# EAGLE design nes-programmer-1 (EAGLE 9.6.2)
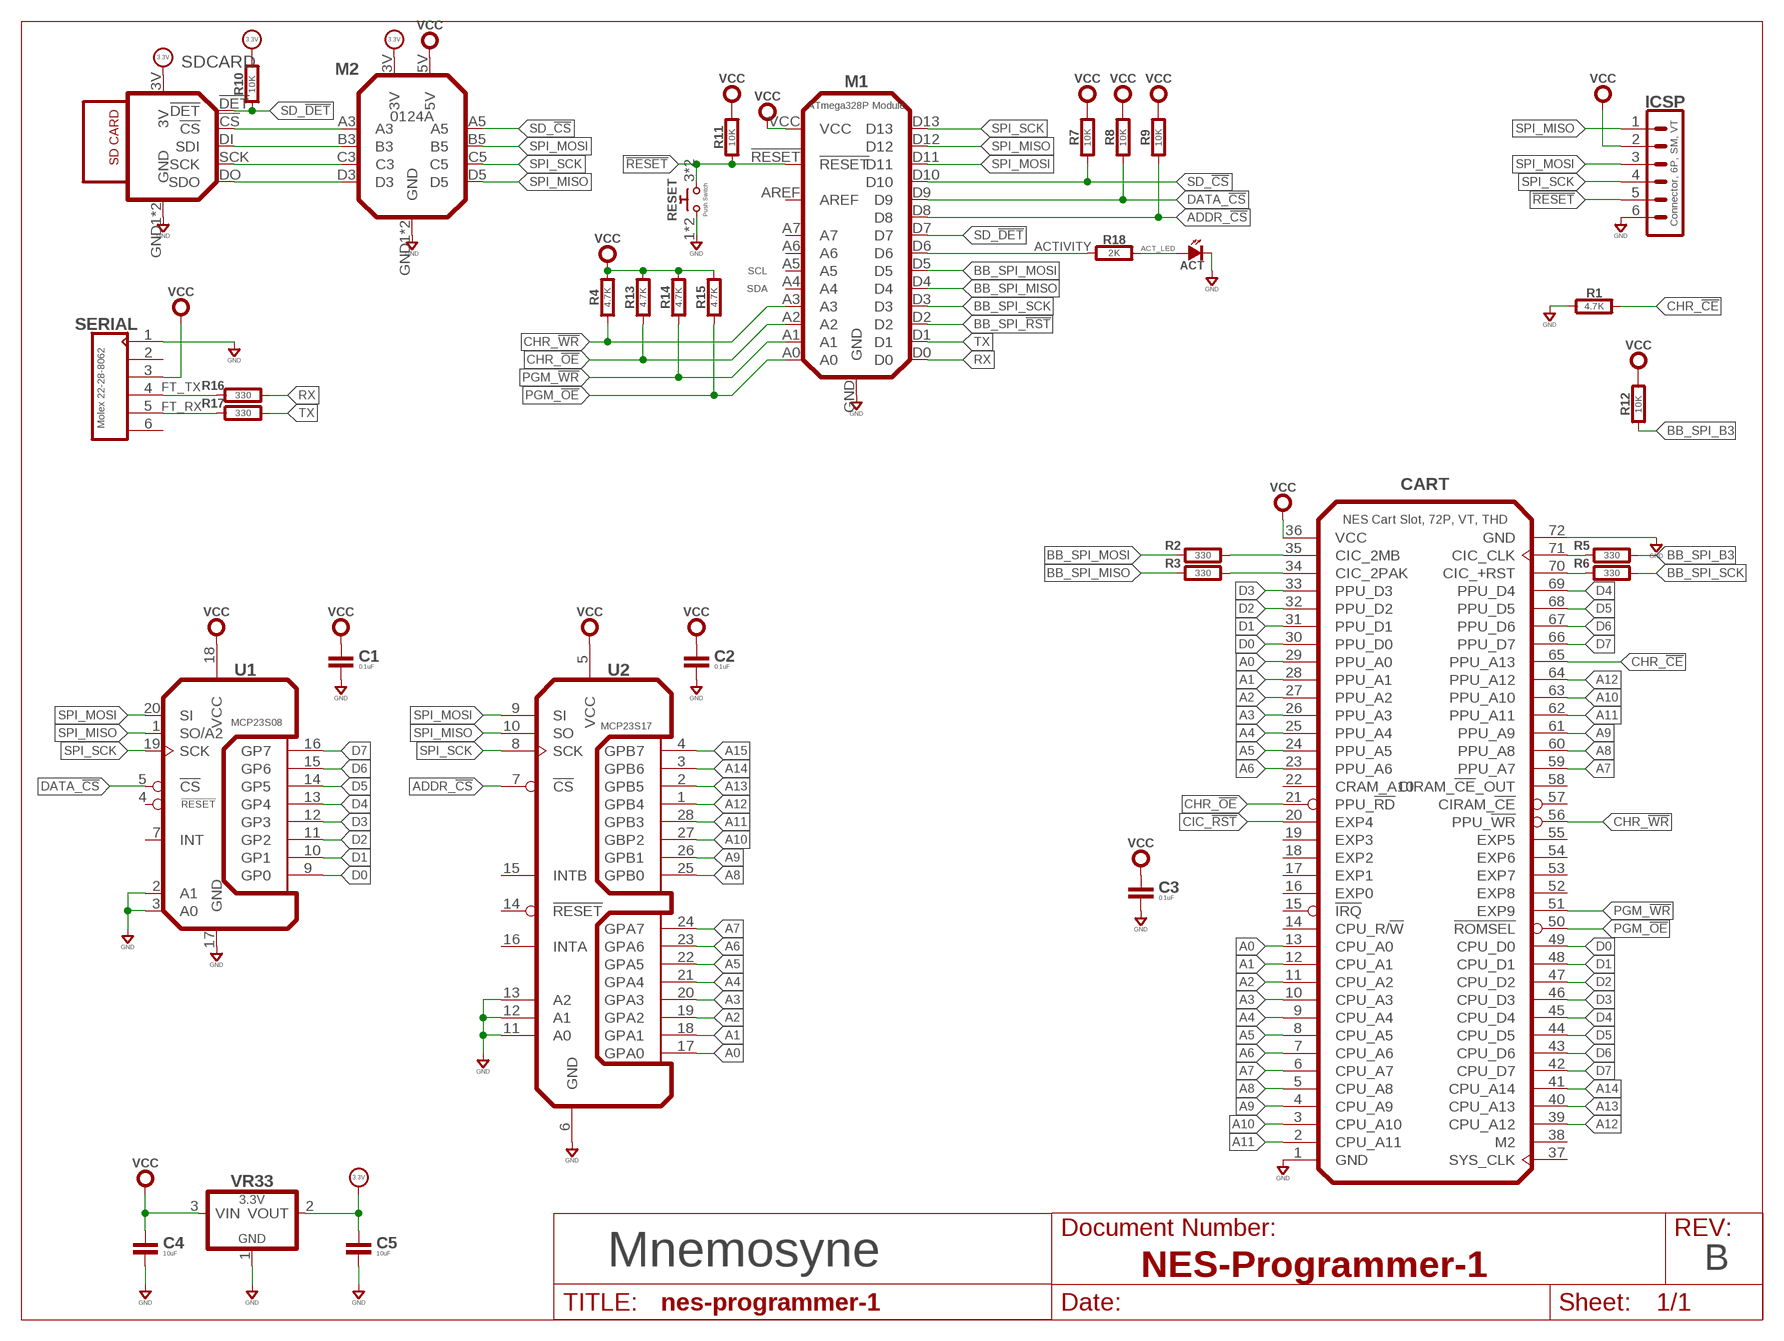
[diagram p0: schematic, sheet 1]
FRAME1 (LETTER_L): DOCUMENT_NUMBER: NES-Programmer-1; REV: B

## Parts
ACT  SMT0603  [SMD_0603]
C1  0.1uF  CAPACITOR0603  [0603-CAP]
C2  0.1uF  CAPACITOR0603  [0603-CAP]
C3  0.1uF  CAPACITOR0603  [0603-CAP]
C4  10uF  CAPACITOR0603  [0603-CAP]
C5  10uF  CAPACITOR0603  [0603-CAP]
CART  NES Cart Slot, 72P, VT, THD  NES-RECEPTACLE-VT-THD  [NES-CONNECTOR-VT-THD]
ICSP  Connector, 6P, SM, VT  06P-SM-VT-SMT  [BM06B-SRSS-TB]
M1  ATmega328P Module  0119REV-A  [0119A]
M2  0124A  0124REV-A  [0124A]
R1  4.7K  RESISTOR0603  [0603-RES]
R2  330  RESISTOR0603  [0603-RES]
R3  330  RESISTOR0603  [0603-RES]
R4  4.7K  RESISTOR0603  [0603-RES]
R5  330  RESISTOR0603  [0603-RES]
R6  330  RESISTOR0603  [0603-RES]
R7  10K  RESISTOR0603  [0603-RES]
R8  10K  RESISTOR0603  [0603-RES]
R9  10K  RESISTOR0603  [0603-RES]
R10  10K  RESISTOR0603  [0603-RES]
R11  10K  RESISTOR0603  [0603-RES]
R12  10K  RESISTOR0603  [0603-RES]
R13  4.7K  RESISTOR0603  [0603-RES]
R14  4.7K  RESISTOR0603  [0603-RES]
R15  4.7K  RESISTOR0603  [0603-RES]
R16  330  RESISTOR0603  [0603-RES]
R17  330  RESISTOR0603  [0603-RES]
R18  2K  RESISTOR0603  [0603-RES]
RESET  Push Switch  PUSHBTN-MOMB3SN  [B3SN]
SDCARD  0127REV-A  [0127A]
SERIAL  Molex 22-28-8062  CON_06X1-RA  [MA06X1-RA-THD]
U1  MCP23S08  MCP23S08-QFN  [QFN-20]
U2  MCP23S17  MCP23S17-QFN  [QFN-28-6X6]
VR33  3.3V  LDO-3P--3.3V-SOT23  [SOT-23]

## Nets
!RESET: ICSP.5 M1.!RESET R11.1 RESET.3 RESET.4
+3.3V: C5.1 M2.3V R10.2 SDCARD.3V VR33.2(VOUT) ; supply symbol labelled 3.3V
A0: CART.13(CPU_A0) CART.29(PPU_A0) U2.17(GPA0)
A1: CART.12(CPU_A1) CART.28(PPU_A1) U2.18(GPA1)
A2: CART.11(CPU_A2) CART.27(PPU_A2) U2.19(GPA2)
A3: CART.10(CPU_A3) CART.26(PPU_A3) U2.20(GPA3)
A4: CART.9(CPU_A4) CART.25(PPU_A4) U2.21(GPA4)
A5: CART.8(CPU_A5) CART.24(PPU_A5) U2.22(GPA5)
A6: CART.7(CPU_A6) CART.23(PPU_A6) U2.23(GPA6)
A7: CART.6(CPU_A7) CART.59(PPU_A7) U2.24(GPA7)
A8: CART.5(CPU_A8) CART.60(PPU_A8) U2.25(GPB0)
A9: CART.4(CPU_A9) CART.61(PPU_A9) U2.26(GPB1)
A10: CART.3(CPU_A10) CART.63(PPU_A10) U2.27(GBP2)
A11: CART.2(CPU_A11) CART.62(PPU_A11) U2.28(GPB3)
A12: CART.39(CPU_A12) CART.64(PPU_A12) U2.1(GPB4)
A13: CART.40(CPU_A13) U2.2(GPB5)
A14: CART.41(CPU_A14) U2.3(GPB6)
A15: U2.4(GPB7)
ACT_LED: ACT.A R18.2
ACTIVITY: M1.D6 R18.1
ADDR_!CS: M1.D8 R9.1 U2.7(!CS)
BB_SPI_!RST: M1.D2
BB_SPI_B3: R5.2 R12.1
BB_SPI_MISO: M1.D4 R3.1
BB_SPI_MOSI: M1.D5 R2.1
BB_SPI_SCK: M1.D3 R6.2
CHR_!CE: CART.65(PPU_A13) R1.2
CHR_!OE: CART.21(PPU_!RD) M1.A2 R13.1
CHR_!WR: CART.56(PPU_!WR) M1.A3 R4.1
CIC_2MB: CART.35(CIC_2MB) R2.2
CIC_2PAK: CART.34(CIC_2PAK) R3.2
CIC_!RST: CART.20(EXP4)
CIC_+RST: CART.70(CIC_+RST) R6.1
CIC_CLK: CART.71(CIC_CLK) R5.1
D0: CART.30(PPU_D0) CART.49(CPU_D0) U1.9(GP0)
D1: CART.31(PPU_D1) CART.48(CPU_D1) U1.10(GP1)
D2: CART.32(PPU_D2) CART.47(CPU_D2) U1.11(GP2)
D3: CART.33(PPU_D3) CART.46(CPU_D3) U1.12(GP3)
D4: CART.45(CPU_D4) CART.69(PPU_D4) U1.13(GP4)
D5: CART.44(CPU_D5) CART.68(PPU_D5) U1.14(GP5)
D6: CART.43(CPU_D6) CART.67(PPU_D6) U1.15(GP6)
D7: CART.42(CPU_D7) CART.66(PPU_D7) U1.16(GP7)
DATA_!CS: M1.D9 R8.1 U1.5(!CS)
FT_RX: R17.1 SERIAL.5
FT_TX: R16.1 SERIAL.4
GND: ACT.K(C) C1.2 C2.2 C3.2 C4.2 C5.2 CART.1(GND) CART.72(GND) ICSP.6 M1.GND M2.GND1(GND) M2.GND2(GND) R1.1 RESET.1 RESET.2 SDCARD.GND1(GND) SDCARD.GND2(GND) SERIAL.1 U1.2(A1) U1.3(A0) U1.17(GND) U2.6(GND) U2.11(A0) U2.12(A1) U2.13(A2) VR33.1(GND)
N$1: M2.D3 SDCARD.DO(SDO)
N$2: M2.C3 SDCARD.SCK
N$3: M2.B3 SDCARD.DI(SDI)
N$5: M2.A3 SDCARD.!CS
PGM_!OE: CART.50(!ROMSEL) M1.A0 R15.1
PGM_!WR: CART.51(EXP9) M1.A1 R14.1
RX: M1.D0 R16.2
SD_!CS: M1.D10 M2.A5 R7.1
SD_!DET: M1.D7 R10.1 SDCARD.!DET
SPI_MISO: ICSP.1 M1.D12 M2.D5 U1.1(SO/A2) U2.10(SO)
SPI_MOSI: ICSP.3 M1.D11 M2.B5 U1.20(SI) U2.9(SI)
SPI_SCK: ICSP.4 M1.D13 M2.C5 U1.19(SCK) U2.8(SCK)
TX: M1.D1 R17.2
VCC: C1.1 C2.1 C3.1 C4.1 CART.36(VCC) ICSP.2 M1.VCC M2.5V R4.2 R7.2 R8.2 R9.2 R11.2 R12.2 R13.2 R14.2 R15.2 SERIAL.3 U1.18(VCC) U2.5(VCC) VR33.3(VIN)
Unconnected: CART.14(CPU_R/!W) CART.15(!IRQ) CART.16(EXP0) CART.17(EXP1) CART.18(EXP2) CART.19(EXP3) CART.22(CRAM_A10) CART.37(SYS_CLK) CART.38(M2) CART.52(EXP8) CART.53(EXP7) CART.54(EXP6) CART.55(EXP5) CART.57(CIRAM_!CE) CART.58(CIRAM_!CE!_OUT) M1.A4 M1.A5 M1.A6 M1.A7 M1.AREF SERIAL.2 SERIAL.6 U1.4(!RESET) U1.7(INT) U2.14(!RESET) U2.15(INTB) U2.16(INTA)

## Notes on the sheet
- SCL
- SDA
- Mnemosyne

## Library data of the parts
ACT = led:SMT: LED SMT; COST01: 0.20; COST10: 0.17; COST100: 0.14
C1-C5 = rlc:CAPACITOR: Capacitor; COST01: 0.12; COST10: 0.09; COST100: 0.05
CART = game-cartridge:NES-RECEPTACLE: Receptacle for NES 72 pin cartridge; COST01: 4.00; COST10: 2.80; COST100: 2.50; MFR: AliExpress; MPN: not defined
ICSP = con-jst:06P: Connector, 6P; COST01: 0.60; COST10: 0.52; COST100: 0.49; MFR: JST; MPN: BM06-SRSS-TB
M1 = circuit-monkey-chips:0119: Circuit Monkey #0119 - ATmega328P Module; COST01: 18.38; COST10: 13.22; COST100: 9.09; MFR: Circuit Monkey; MPN: 0119A
M2 = circuit-monkey-chips:0124: Logic Level Translator; COST01: 5.17; COST10: 3.60; COST100: 1.86; MFR: Circuit Monkey; MPN: 0124A
R1-R18 = rlc:RESISTOR: Resistor; COST01: 0.10; COST10: 0.05; COST100: 0.02
RESET = switch-smd:PUSHBTN-MOM: Pushbutton Switch; COST01: 1.05; COST10: 0.95; COST100: 0.75; MFR: Omron; MPN: B3SN
SDCARD = circuit-monkey-chips:0127: 0127 SD Card Micro; COST01: 8.23; COST10: 5.24; COST100: 4.02; MFR: Circuit Monkey; MPN: 0127
SERIAL = con-headers:CON_06X1: Header, 6-pin, single row; COST01: 0.30; COST10: 0.20; COST100: 0.10
U1 = co-microchip:MCP23S08: Microchip 8-bit SPI I/O Expander; COST01: 1.65; COST10: 1.65; COST100: 1.32; MFR: Microchip; MPN: MCP23S08-E/ML
U2 = co-microchip:MCP23S17: 16-Bit I/O Expander with SPI Interface; COST01: 2.20; COST10: 2.10; COST100: 1.70; MFR: Microchip; MPN: MCP23S17-x/ML
VR33 = regulators:LDO-3P-: regulator 3-pin; COST01: 0.76; COST10: 0.66; COST100: 0.55; MPN: AP2120N-3.3; MPN2: XC6206P332MR-G; MPN3: AP7387-33SA; SEEED: 310030099

## Board
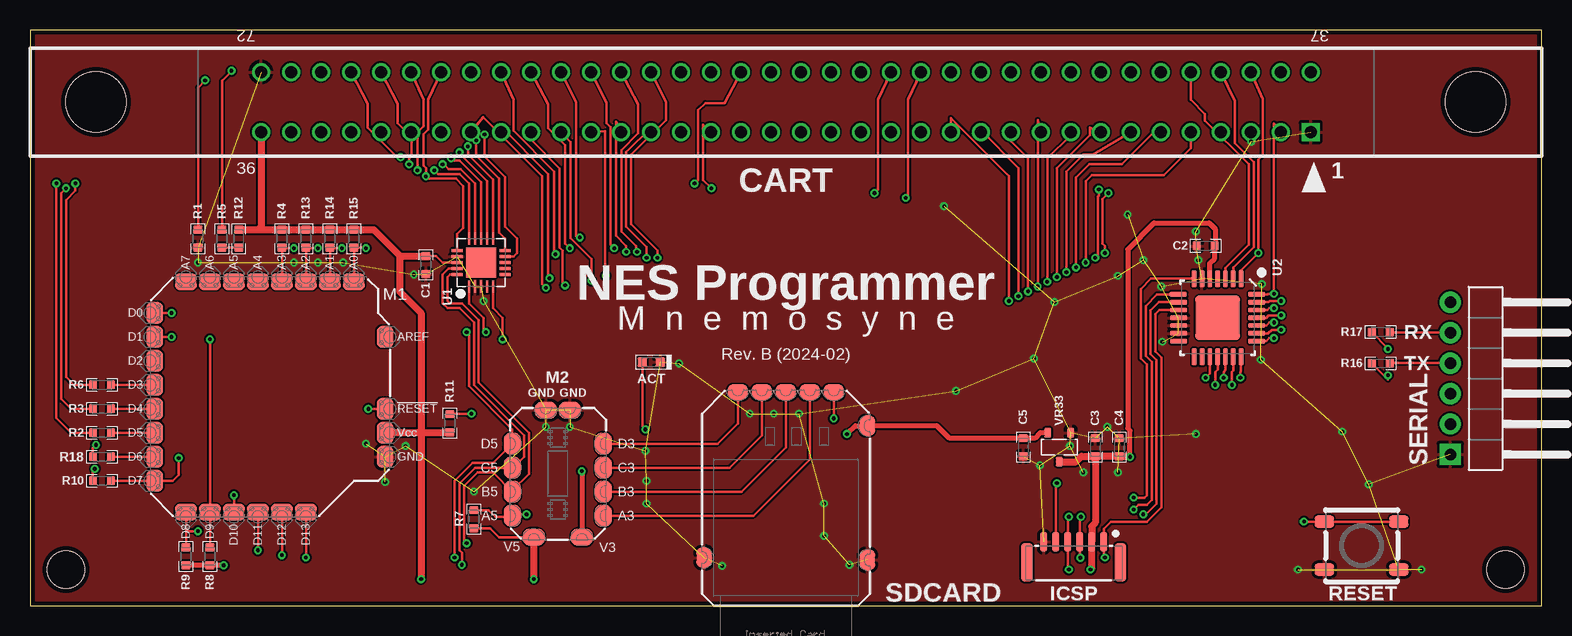
[diagram p1: board, top side]
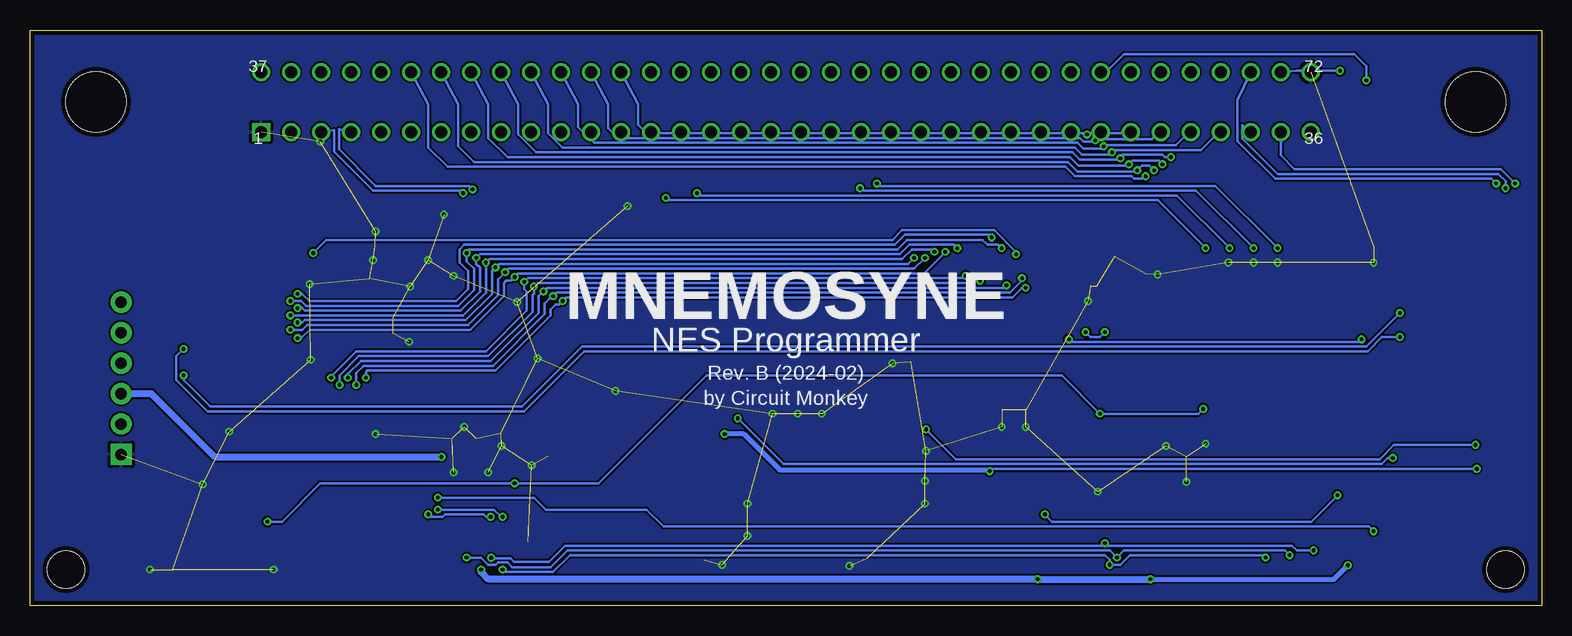
[diagram p2: board, bottom side, seen from below]

Size 126 x 48 mm. Coordinates in mm from the lower left corner, seen from the top.
Outline: 0,0 126,0 126,48 0,48 0,0
Copper layers (1*16): Top 0.0356mm / dielectric 1.5011mm / Bottom 0.0356mm
Design rules "OSH-CircuitMonkey": minimum track width 6mil, minimum drill 12mil, track to track 6mil, track to pad 6mil, pad to pad 6mil, via to via 6mil, smd to smd 6mil, copper to edge 15mil, drill to drill 6mil, minimum pad ring 7mil, minimum via ring 7mil, stop-mask expansion 3mil, vias tented up to drill 13mil, thermal gap 10mil
Holes 3.1 mm at 3,3 123,3

### Footprints (pad centres in the part's own frame; a part is rotated, then mirrored left to right if it is on the bottom)
SMD_0603 = smd 0.8 x 0.8: A 0.75,0; K -0.75,0
0603-CAP = smd 0.711 x 0.762: 1 -0.752,0; 2 0.752,0
NES-CONNECTOR-VT-THD = drill 1 square: 1 43.75,-2.5 | drill 1: 2 41.25,-2.5; 3 38.75,-2.5; 4 36.25,-2.5; 5 33.75,-2.5; 6 31.25,-2.5; 7 28.75,-2.5; 8 26.25,-2.5; 9 23.75,-2.5; 10 21.25,-2.5; 11 18.75,-2.5; 12 16.25,-2.5; 13 13.75,-2.5; 14 11.25,-2.5; 15 8.75,-2.5; 16 6.25,-2.5; 17 3.75,-2.5; 18 1.25,-2.5; 19 -1.25,-2.5; 20 -3.75,-2.5; 21 -6.25,-2.5; 22 -8.75,-2.5; 23 -11.25,-2.5; 24 -13.75,-2.5; 25 -16.25,-2.5; 26 -18.75,-2.5; 27 -21.25,-2.5; 28 -23.75,-2.5; 29 -26.25,-2.5; 30 -28.75,-2.5; 31 -31.25,-2.5; 32 -33.75,-2.5; 33 -36.25,-2.5; 34 -38.75,-2.5; 35 -41.25,-2.5; 36 -43.75,-2.5; 37 43.75,2.5; 38 41.25,2.5; 39 38.75,2.5; 40 36.25,2.5; 41 33.75,2.5; 42 31.25,2.5; 43 28.75,2.5; 44 26.25,2.5; 45 23.75,2.5; 46 21.25,2.5; 47 18.75,2.5; 48 16.25,2.5; 49 13.75,2.5; 50 11.25,2.5; 51 8.75,2.5; 52 6.25,2.5; 53 3.75,2.5; 54 1.25,2.5; 55 -1.25,2.5; 56 -3.75,2.5; 57 -6.25,2.5; 58 -8.75,2.5; 59 -11.25,2.5; 60 -13.75,2.5; 61 -16.25,2.5; 62 -18.75,2.5; 63 -21.25,2.5; 64 -23.75,2.5; 65 -26.25,2.5; 66 -28.75,2.5; 67 -31.25,2.5; 68 -33.75,2.5; 69 -36.25,2.5; 70 -38.75,2.5; 71 -41.25,2.5; 72 -43.75,2.5 | hole 5: -57.5,0; 57.5,0
BM06B-SRSS-TB = smd 0.6 x 1.6: 1 -2.5,-0.3; 2 -1.5,-0.3; 3 -0.5,-0.3; 4 0.5,-0.3; 5 1.5,-0.3; 6 2.5,-0.3 | smd 1 x 3.2: MTG1 3.9,1.4; MTG2 -3.9,1.4
0119A = smd 1.4 x 1.8: !RESET 9.6,-1; AREF 9.6,5; D0 -9.6,7; D1 -9.6,5; D2 -9.6,3; D3 -9.6,1; D4 -9.6,-1; D5 -9.6,-3; D6 -9.6,-5; D7 -9.6,-7; GND 9.6,-5; VCC 9.6,-3 | smd 1.8 x 1.4: A0 7,9.6; A1 5,9.6; A2 3,9.6; A3 1,9.6; A4 -1,9.6; A5 -3,9.6; A6 -5,9.6; A7 -7,9.6; D8 -7,-9.6; D9 -5,-9.6; D10 -3,-9.6; D11 -1,-9.6; D12 1,-9.6; D13 3,-9.6
0124A = smd 1.8 x 1.4: 3V -2,5.3; 5V 2,5.3; GND1 -1,-5.3; GND2 1,-5.3 | smd 1.4 x 1.8: A3 -3.8,3.5; A5 3.8,3.5; B3 -3.8,1.5; B5 3.8,1.5; C3 -3.8,-0.5; C5 3.8,-0.5; D3 -3.8,-2.5; D5 3.8,-2.5
0603-RES = smd 0.711 x 0.762: 1 -0.752,0; 2 0.752,0
B3SN = smd 1.6 x 1: 1 3.1,-2; 2 -3.1,-2; 3 3.1,2; 4 -3.1,2
0127A = smd 1.7 x 1.3: 3V -6,6.8; GND1 5.2,6.8; GND2 5,-6.8 | smd 1.3 x 1.7: !CS -8.8,2; !DET -8.8,4; DI -8.8,0; DO -8.8,-4; SCK -8.8,-2
MA06X1-RA-THD = drill 0.965 pad 1.778 square: 1 0,0 | drill 0.965 pad 1.778: 2 2.54,0; 3 5.08,0; 4 7.62,0; 5 10.16,0; 6 12.7,0
QFN-20 = smd 1 x 0.25: 1 -2,1; 2 -2,0.5; 3 -2,0; 4 -2,-0.5; 5 -2,-1; 11 2,-1; 12 2,-0.5; 13 2,0; 14 2,0.5; 15 2,1 | smd 0.25 x 1: 6 -1,-2; 7 -0.5,-2; 8 0,-2; 9 0.5,-2; 10 1,-2; 16 1,2; 17 0.5,2; 18 0,2; 19 -0.5,2; 20 -1,2 | smd 2.5 x 2.5: PAD 0,0
QFN-28-6X6 = smd 3.7 x 3.7: 0 0,0 | smd 1.4 x 0.4: 1 -3.258,1.95; 2 -3.258,1.3; 3 -3.258,0.65; 4 -3.258,0; 5 -3.258,-0.65; 6 -3.258,-1.3; 7 -3.258,-1.95; 15 3.258,-1.95; 16 3.258,-1.3; 17 3.258,-0.65; 18 3.258,0; 19 3.258,0.65; 20 3.258,1.3; 21 3.258,1.95 | smd 0.4 x 1.4: 8 -1.95,-3.279; 9 -1.3,-3.258; 10 -0.65,-3.258; 11 0,-3.258; 12 0.65,-3.258; 13 1.3,-3.258; 14 1.95,-3.258; 22 1.95,3.258; 23 1.3,3.258; 24 0.65,3.258; 25 0,3.258; 26 -0.65,3.258; 27 -1.3,3.258; 28 -1.95,3.258
SOT-23 = smd 0.6 x 0.8: 1 0.95,1.2; 2 -0.95,1.2; 3 0,-1.2

### Placement (x,y rotation side)
ACT  51.8,20.3 180 top
C1  33,28.4 270 top
C2  98,30 180 top
C3  88.8,13.2 90 top
C4  90.8,13.2 90 top
C5  82.8,13.2 270 top
CART  63,42 0 top
ICSP  87,5 180 top
M1  20,17.4 0 top
M2  44,11 180 top
R1  14,30.6 90 top
R2  6,14.4 180 top
R3  6,16.4 180 top
R4  21,30.6 90 top
R5  16,30.6 270 top
R6  6,18.4 0 top
R7  37,7.2 270 top
R8  15,4.1 270 top
R9  13,4.1 270 top
R10  6,10.4 180 top
R11  35,15.2 270 top
R12  17.4,30.6 90 top
R13  23,30.6 90 top
R14  25,30.6 90 top
R15  27,30.6 90 top
R16  112.6,20.2 180 top
R17  112.6,22.8 180 top
R18  6,12.4 180 top
RESET  111,5 0 top
SDCARD  63,9 270 top
SERIAL  118.4,12.6 90 top
U1  37.6,28.6 90 top
U2  99,24 270 top
VR33  85.8,13.2 0 top

### Tracks (layer width: path | path; a pad name or v marks a point on that pad's centre or on a via)
!RESET  (via drill 0.3)
  Top 0.2: ICSP.5 85.5,10.1 v85.6,10.2 | v36.8,16 35.05,16 R11.1 | v28.2,16.4 M1.!RESET | v106.2,7 RESET.4 RESET.3
  Bottom 0.2: v28.2,16.4 28.6,16 v36.8,16 40,19.2 69.6,19.2 78.6,10.2 v85.6,10.2 101.8,10.2 105,7 v106.2,7
+3.3V  (via drill 0.3)
  Top 0.2: v5.4,11.4 5.25,11.25 R10.2
  Top 0.4: v46,11.2 M2.3V | VR33.2 84.2,14.4 83.75,13.95 C5.1 76.65,13.95 75.6,15 SDCARD.3V 68.8,15 v68.1,14.3
  Bottom 0.2: v46,11.2 45.8,11.4 v5.4,11.4
  Bottom 0.4: v46,11.2 46.1,11.3 63.5,11.3 66.5,14.3 v68.1,14.3
A0  (via drill 0.3)
  Top 0.2: v81.6,25.4 81.6,35.8 76.75,40.65 CART.13 | CART.29 37.77,40.75 42.7,35.82 42.7,26.8 v43,26.5 | U2.17 98.35,19.35 v98,19
  Bottom 0.2: v98,19 98,19.5 97.9,19.6 87.2,19.6 82.6,24.2 82.6,24.7 82.2,25.1 81.9,25.1 v81.6,25.4 81.3,25.7 44.1,25.7 43.3,26.5 v43,26.5
A1  (via drill 0.3)
  Top 0.2: v82.4,25.8 82.4,36.5 79.25,39.65 CART.12 | CART.28 39.25,39.95 43.2,36 43.2,27.4 v43.3,27.3 | U2.18 99,19.7 98.8,19.5 v98.8,18.4
  Bottom 0.2: v98.8,18.4 98.8,19.4 98.2,20 87.4,20 83.1,24.3 83.1,25.2 82.7,25.6 82.6,25.6 v82.4,25.8 82.1,26.1 44.3,26.1 43.3,27.1 v43.3,27.3
A2  (via drill 0.3)
  Top 0.2: CART.27 41.75,38.85 44.15,36.45 44.15,29.85 44.4,29.6 44.4,26.9 v44.6,26.7 | CART.11 81.75,38.75 83.2,37.3 v83.2,26.2 | U2.19 99.65,19.64 99.51,19.5 v99.51,19
  Bottom 0.2: v99.51,19 99.51,19.3 98.41,20.4 87.6,20.4 83.6,24.4 83.6,25.8 v83.2,26.2 82.9,26.5 44.8,26.5 v44.6,26.7
A3  (via drill 0.3)
  Top 0.2: CART.26 44.25,39.45 45.05,38.65 45.05,30.65 46.8,28.9 v46.8,27.1 | U2.20 100.3,19.6 100.2,19.5 v100.2,18.4 | CART.10 84,40.5 v84,26.6
  Bottom 0.2: v100.2,18.4 100.2,19.2 98.6,20.8 87.8,20.8 84.1,24.5 84.1,25.9 84,26 v84,26.6 83.7,26.9 47.71,26.9 47.51,27.1 v46.8,27.1
A4  (via drill 0.3)
  Top 0.2: CART.25 47.95,39.55 47.95,27.55 v48,27.5 | CART.9 86.75,39.25 84.8,37.3 v84.8,27 | U2.21 100.95,19.55 100.9,19.5 v100.9,19
  Bottom 0.2: v100.9,19 100.9,19.1 98.8,21.2 88,21.2 84.6,24.6 84.6,26.2 84.8,26.4 v84.8,27 84.5,27.3 48.2,27.3 v48,27.5
A5  (via drill 0.3)
  Top 0.2: CART.24 48.85,40.35 48.85,30.85 49.7,30 v49.7,29.5 | CART.8 88.35,39.85 88.35,39.25 85.6,36.5 v85.6,27.4 | U2.22 103.05,22.05 103.3,22.3 v103.7,22.3
  Bottom 0.2: v103.7,22.3 103.4,22.3 102.7,23 89.3,23 86.5,25.8 86.5,26.9 86.3,27.1 85.9,27.1 v85.6,27.4 85.3,27.7 51.5,27.7 v49.7,29.5
A6  (via drill 0.3)
  Top 0.2: v51.4,29 51.4,29.9 49.7,31.6 49.7,37.8 51.75,39.85 CART.23 | CART.7 88.6,37.6 87.8,37.6 86.4,36.2 v86.4,27.8 | v104.3,23 103.5,23 103.2,22.7 U2.23
  Bottom 0.2: v104.3,23 103.3,23 102.9,23.4 89.5,23.4 87,25.9 87,27.2 v86.4,27.8 86.1,28.1 52.3,28.1 v51.4,29
A7  (via drill 0.3)
  Top 0.2: CART.59 53,42 53,40.5 50.1,37.6 50.1,31.8 52.3,29.6 v52.3,29 | CART.6 94.25,40.05 91,36.8 88.3,36.8 87.2,35.7 v87.2,28.2 | U2.24 103.05,23.35 103.3,23.6 v103.7,23.6
  Bottom 0.2: v103.7,23.6 103.3,23.6 103.1,23.8 89.7,23.8 87.5,26 87.5,27.9 v87.2,28.2 86.9,28.5 52.8,28.5 v52.3,29
A8  (via drill 0.3)
  Top 0.2: v88,28.6 88,35.4 88.5,35.9 94.5,35.9 96.75,38.15 CART.5 | CART.60 50.7,41.8 50.7,39.4 49.3,38 49.3,31.2 50.5,30 50.5,29.6 v50.6,29.5 | U2.25 103.04,24 103.24,24.2 v104.3,24.2
  Bottom 0.2: v104.3,24.2 89.9,24.2 88,26.1 v88,28.6 87.7,28.9 53.3,28.9 52.5,29.7 50.8,29.7 v50.6,29.5
A9  (via drill 0.3)
  Top 0.2: CART.61 48.05,41.95 48.05,40.25 48.4,39.9 48.4,30.1 v48.7,29.8 | v89.1,34.7 89.1,34.2 89,34.1 89,29.2 v88.8,29 | U2.26 103.15,24.65 103.3,24.8 v103.7,24.8
  Bottom 0.2: v103.7,24.8 103.3,24.8 103.1,24.6 90.1,24.6 88.5,26.2 88.5,28.2 88.8,28.5 v88.8,29 88.5,29.3 53.5,29.3 52.7,30.1 49,30.1 v48.7,29.8 | v89.1,34.7 89.4,35 97.2,35 100.25,38.05 100.25,39.75 CART.4
A10  (via drill 0.3)
  Top 0.2: v89.9,34.4 89.4,33.9 89.4,30.2 89.6,30 v89.6,29.4 | CART.63 43.2,41.8 43.2,39.8 44.6,38.4 44.6,30.2 v45,29.8 | U2.27 103.24,25.3 103.35,25.41 v104.3,25.41 v104.3,25.4
  Bottom 0.2: v104.3,25.4 103.4,25.4 103,25 90.3,25 89,26.3 89,28.1 89.6,28.7 v89.6,29.4 89.6,29.5 89.4,29.7 53.7,29.7 52.9,30.5 46.6,30.5 46.2,30.1 45.3,30.1 v45,29.8 | v89.9,34.4 90.1,34.6 97.4,34.6 100.65,37.85 100.65,39.65 CART.3
A11  (via drill 0.3)
  Top 0.2: CART.62 45.5,42 45.5,30.8 45.72,30.59 v45.83,30.7 | CART.2 103.7,40.2 v103.7,26 103.2,26 103.15,25.95 U2.28
  Bottom 0.2: v103.7,26 103.3,26 102.7,25.4 90.5,25.4 89.5,26.4 89.5,27.9 90.2,28.6 90.2,29.7 89.8,30.1 53.9,30.1 53.07,30.93 46.06,30.93 v45.83,30.7
A12  (via drill 0.3)
  Top 0.2: CART.64 40.3,42.2 40.3,39.6 43.7,36.2 43.7,29.4 v43.8,29.3 | CART.39 102.75,42.25 102.75,37.55 102.4,37.2 v102.4,29.4 100.95,27.95 U2.1
  Bottom 0.2: v102.4,29.4 101.3,30.5 54.1,30.5 53.3,31.3 45.6,31.3 43.8,29.5 v43.8,29.3
A13
  Top 0.2: CART.40 100.45,42.05 100.45,38.55 102,37 102,29.9 100.3,28.2 U2.2
A14
  Top 0.2: CART.41 96.75,42.17 97.95,40.97 97.95,40.45 101.6,36.8 101.6,30.1 99.65,28.15 U2.3
ACT_LED  (via drill 0.3)
  Top 0.2: R18.2 5.25,13.15 v5.5,13.4 | ACT.A 51.05,14.93 v51.3,14.68
  Bottom 0.2: v51.3,14.68 48.82,12.2 13.5,12.2 12.3,13.4 v5.5,13.4
ACTIVITY
  Top 0.2: M1.D6 R18.1
ADDR_!CS  (via drill 0.3)
  Top 0.2: U2.7 93.46,27.26 92.6,26.4 92.6,20.6 93.1,20.1 93.1,9.2 92.9,9 v92,9 | M1.D8 13,6.2 | 13,6.2 R9.1 | v14,6.2 13,6.2
  Bottom 0.2: v14,6.2 14.4,6.6 73.2,6.6 74.6,8 83,8 84,9 v92,9
BB_SPI_B3
  Top 0.2: R5.2 R12.1
BB_SPI_MISO
  Top 0.2: M1.D4 R3.1
BB_SPI_MOSI
  Top 0.2: M1.D5 R2.1
BB_SPI_SCK
  Top 0.2: M1.D3 R6.2
CHR_!CE  (via drill 0.3)
  Top 0.2: v14.6,43.8 14,43.2 R1.2
  Bottom 0.2: CART.65 36.75,44.05 34.8,46 15.6,46 14.6,45 v14.6,43.8
CHR_!OE  (via drill 0.3)
  Top 0.2: v24,29.8 23.05,29.8 R13.1 M1.A2 | v56.8,34.8 56.1,35.5 56.1,40.1 CART.21
  Bottom 0.2: v24,29.8 28.8,34.6 56.6,34.6 v56.8,34.8
CHR_!WR  (via drill 0.3)
  Top 0.2: v22,29.8 21.05,29.8 | 21.05,29.8 R4.1 | v55.4,35.2 55.7,35.5 55.7,41.3 56.3,41.9 57.9,41.9 CART.56 | M1.A3 21,29.75 21.05,29.8
  Bottom 0.2: v22,29.8 27.2,35 55.2,35 v55.4,35.2
CIC_2MB  (via drill 0.3)
  Top 0.2: R2.2 3.45,14.4 2.2,15.65 v2.2,35.2
  Bottom 0.2: CART.35 21.75,37.55 20.6,36.4 3.4,36.4 v2.2,35.2
CIC_2PAK  (via drill 0.3)
  Top 0.2: R3.2 3.45,16.4 2.6,17.25 2.6,34.4 v3,34.8
  Bottom 0.2: v3,34.8 3,35.4 3.6,36 22,36 24.95,38.95 24.95,40.05 CART.34
CIC_+RST  (via drill 0.3)
  Top 0.2: v3.78,35.2 3.78,34.6 3,33.82 3,19.05 3.65,18.4 R6.1
  Bottom 0.2: CART.70 25.35,42.15 25.35,38.75 22.2,35.6 4.18,35.6 v3.78,35.2
CIC_CLK  (via drill 0.3)
  Top 0.2: v16.8,44.6 16.8,44.55 16,43.75 R5.1
  Bottom 0.2: CART.71 20.4,44.6 v16.8,44.6
D0  (via drill 0.3)
  Top 0.2: v37.9,39.28 37.9,37.44 39.6,35.74 39.6,31.6 40.6,30.6 40.6,29.4 40.3,29.1 U1.9
  Bottom 0.2: CART.49 75.3,41.8 75.3,40.1 74.6,39.4 38.02,39.4 v37.9,39.28 37.78,39.4 34.63,39.4 34.25,39.78 CART.30
D1  (via drill 0.3)
  Top 0.2: v37.2,38.8 37.2,37.52 39.1,35.62 39.1,31.1 39.6,30.6 U1.10
  Bottom 0.2: CART.48 77.8,41.8 77.8,39.8 77,39 38.5,39 38.2,38.7 37.3,38.7 v37.2,38.8 37.1,38.9 32.5,38.9 31.75,39.65 CART.31
D2  (via drill 0.3)
  Top 0.2: v36.5,38.3 36.5,37.6 38.6,35.53 U1.11
  Bottom 0.2: CART.47 80.3,41.8 80.3,39.9 79,38.6 38.7,38.6 38.2,38.1 36.7,38.1 v36.5,38.3 36.5,38.4 30.47,38.4 29.25,39.62 CART.32
D3  (via drill 0.3)
  Top 0.2: v35.8,37.8 35.8,37.7 38.1,35.4 U1.12
  Bottom 0.2: CART.46 82.8,41.8 82.8,39.4 81.6,38.2 38.9,38.2 38.3,37.6 36,37.6 v35.8,37.8 35.6,38 28.4,38 26.75,39.65 CART.33
D4  (via drill 0.3)
  Top 0.2: U1.13 37.6,35.3 35.8,37.1 35.3,37.1 v35.1,37.3 | CART.69 28.15,41.85 28.15,39.85 30.6,37.4 v30.9,37.4
  Bottom 0.2: CART.45 85.3,41.8 85.3,39.3 83.8,37.8 39.1,37.8 38.5,37.2 35.2,37.2 v35.1,37.3 35.1,37.4 34.9,37.6 31.6,37.6 31.4,37.4 v30.9,37.4
D5  (via drill 0.3)
  Top 0.2: v34.4,36.8 34.5,36.8 34.9,36.4 35.9,36.4 37.1,35.2 U1.14 | v31.6,36.8 31.6,37.3 31.8,37.5 31.8,39.1 30.65,40.25 30.65,41.85 CART.68
  Bottom 0.2: CART.44 87.8,41.8 87.8,39 86.2,37.4 39.3,37.4 38.6,36.7 34.5,36.7 v34.4,36.8 34.1,37.1 31.9,37.1 v31.6,36.8
D6  (via drill 0.3)
  Top 0.2: v32.3,36.3 32.3,39.5 32.8,40 32.8,42.2 CART.67 | U1.15 36.6,35.2 35.8,36 34,36 v33.7,36.3
  Bottom 0.2: CART.43 90.3,41.8 90.3,38.3 89,37 39.5,37 38.7,36.2 33.8,36.2 v33.7,36.3 33.29,36.71 32.71,36.71 v32.3,36.3
D7  (via drill 0.3)
  Top 0.2: CART.66 33.2,42.2 33.2,39.7 32.8,39.3 32.8,36.7 33,36.5 v33,35.8 33.2,35.6 35.5,35.6 36.1,35 36.1,31.5 35.6,31 U1.16
  Bottom 0.2: CART.42 92.8,41.8 92.8,38.2 91.2,36.6 39.7,36.6 38.9,35.8 34.2,35.8 34,35.6 33.3,35.6 33.1,35.8 v33,35.8
DATA_!CS  (via drill 0.3)
  Top 0.2: v15,22.2 M1.D9 R8.1 | v39.4,22.2 39.4,24 38.6,24.8 U1.5
  Bottom 0.2: v15,22.2 15.2,22 39.2,22 v39.4,22.2
FT_RX
  Top 0.2: SERIAL.5 113.39,22.76 R17.1
FT_TX
  Top 0.2: SERIAL.4 113.37,20.22 R16.1
GND  (via drill 0.3)  (72 unrouted)
  other vias: 37.8,25.4 32,27.6 94.4,22 97.4,28.8 60,16 62,16 64.1,16 51.4,8.5 51.4,10.4 51.3,12.9 37,9.5 26.1,28.6 24,28.6 22,28.6 14,28.6 28,13.5 31.3,13.3 29.6,10.3 45,14.9 43,14.9 57.7,3.3 68.3,3.4 66.2,8.5 66.2,5.8 77.2,17.9 83.7,20.6 85.4,25.3 92.8,28.8 91.5,32.6 76.2,33.3 97.2,14.3 109.4,14.5 111.6,10.1 116,3 105.7,3 94.3,26.6 102.6,20.5 102.7,26.8 101.8,38.7 89.8,14.9 86.7,13.3 84.2,11.7 90.7,11.1 87.8,11.1 90.7,27.5 97.2,31.2 54.1,20.2
  pour Top: 0,0 0,48 126,48 126,0
  pour Bottom: 0,0 0,48 126,48 126,0
N$1
  Top 0.2: M2.D3 57.3,13.5 59,15.2 SDCARD.DO
N$2
  Top 0.2: M2.C3 58.3,11.5 61,14.2 SDCARD.SCK
N$3
  Top 0.2: M2.B3 59.3,9.5 63,13.2 SDCARD.DI
N$5
  Top 0.2: M2.A3 60.3,7.5 65,12.2 SDCARD.!CS
PGM_!OE  (via drill 0.3)
  Top 0.2: v73,34 73.2,34.2 73.2,42.2 CART.50 | M1.A0 R15.1 27.95,29.85 v28,29.8
  Bottom 0.2: v28,29.8 32,33.8 72.8,33.8 v73,34
PGM_!WR  (via drill 0.3)
  Top 0.2: v26,29.8 25.05,29.8 | 25.05,29.8 R14.1 | v70.4,34.4 70.7,34.7 70.7,42.2 CART.51 | M1.A1 25,29.75 25.05,29.8
  Bottom 0.2: v26,29.8 30.4,34.2 70.2,34.2 v70.4,34.4
RX  (via drill 0.3)
  Top 0.2: R16.2 113.2,18.85 v113.2,19.2 | v11.8,24.4 M1.D0
  Bottom 0.2: v113.2,19.2 113.2,18.8 111,16.6 85,16.6 80,21.6 14.6,21.6 v11.8,24.4
SD_!CS  (via drill 0.3)
  Top 0.2: R7.1 38.25,7.95 38.8,7.4 40.1,7.4 M2.A5 40.3,7.6 v41.4,7.6 | v17,9.2 M1.D10
  Bottom 0.2: v41.4,7.6 40.8,7 19.2,7 v17,9.2
SD_!DET  (via drill 0.3)
  Top 0.2: v67,15.6 SDCARD.!DET | v12.4,12.3 12.4,10.9 11.9,10.4 M1.D7 R10.1
  Bottom 0.2: v12.4,12.3 12.8,12.3 13.3,11.8 63.2,11.8 v67,15.6
SPI_MISO  (via drill 0.3)
  Top 0.2: U2.10 94.15,24.65 93.8,24.3 93.8,21.2 94.3,20.7 94.3,8.2 93.1,7 90.1,7 89.5,6.4 ICSP.1 89.5,4.1 v89.6,4 | v35.4,4 35.4,10.4 36.9,11.9 38.6,11.9 M2.D5 40.2,14.7 36.6,18.3 36.6,22.6 v36.4,22.8 | M1.D12 v21,4.2 | v38,22.8 37.8,23 37.8,24 36.6,25.2 U1.1
  Bottom 0.2: v89.6,4 88.4,4 87.8,3.4 87.2,3.4 87,3.6 86.2,3.6 85.8,3.2 82.6,3.2 81.2,4.6 36,4.6 v35.4,4 34.8,4.6 21.4,4.6 v21,4.2 | v36.4,22.8 36.8,22.4 37.6,22.4 v38,22.8
SPI_MOSI  (via drill 0.3)
  Top 0.2: U2.9 94.1,25.3 93.4,24.6 93.4,21 93.9,20.5 93.9,8.5 93,7.6 v92.8,7.6 | v87.6,7.4 87.5,7.3 ICSP.3 87.5,4.04 v87.56,3.98 | v36.4,5.2 36.2,5.4 36.2,10 37.3,11.1 38.6,11.1 M2.B5 40.2,9.6 41.6,11 41.6,14.4 37.4,18.6 37.4,23.8 36,25.2 35,25.2 34.8,25.4 34.8,27.4 35,27.6 U1.20 | M1.D11 v19,4.6
  Bottom 0.2: v92.8,7.6 92.6,7.4 91.6,7.4 91.4,7.6 88.2,7.6 88,7.4 v87.6,7.4 | v87.56,3.98 87.53,3.95 85.95,3.95 85.65,3.65 82.75,3.65 81.4,5 36.6,5 v36.4,5.2 36.2,5 20.8,5 20.4,4.6 v19,4.6
SPI_SCK  (via drill 0.3)
  Top 0.2: U2.8 93.95,25.95 93,25 93,20.8 93.5,20.3 93.5,8.8 93.1,8.4 92.4,8.4 v92,8 | v86.6,7.4 86.5,7.3 ICSP.4 86.5,3.1 v86.6,3 | v36,3.4 36,4.4 35.8,4.6 35.8,10.2 37.1,11.5 M2.C5 40.3,11.5 41.2,12.4 41.2,14.2 37,18.4 37,23.6 35.8,24.8 34.8,24.8 34.4,25.2 34.4,27.6 34.9,28.1 U1.19 | M1.D13 v23,4
  Bottom 0.2: v92,8 87.3,8 86.7,7.4 v86.6,7.4 | v86.6,3 86.4,2.8 82.4,2.8 81,4.2 36.4,4.2 36,3.8 v36,3.4 35.1,3.4 34.3,4.2 23.2,4.2 v23,4
TX  (via drill 0.3)
  Top 0.2: R17.2 113.2,21.45 v113.2,21.4 | v11.8,22.4 M1.D1
  Bottom 0.2: v113.2,21.4 113.8,20.8 113.8,18.8 111.2,16.2 84.8,16.2 79.8,21.2 14.5,21.2 13.3,22.4 v11.8,22.4
VCC  (via drill 0.3)
  Top 0.2: R7.2 38.35,6.45 39.1,5.7 M2.5V | M1.VCC 29.65,14.45 | U1.18 34.4,28.6 33.85,29.15 C1.1
  Top 0.4: v16.15,3.35 R8.2 R9.2 | U2.5 98.35,28.55 98.75,28.95 C2.1 98.8,30.05 98.8,31.4 98.3,31.9 93.7,31.9 91.5,29.7 91.5,14.8 91.7,14.6 v91.7,12.4
  Top 0.6: R12.2 19,31.35 | 19,31.35 R4.2 R13.2 R14.2 R15.2 28.65,31.35 30.85,29.15 | CART.36 19.25,31.6 19,31.35 | 30.85,29.15 C1.1 | 29.65,14.45 32.6,14.45 | 32.6,14.45 R11.2 | 30.85,29.15 30.85,26.15 32.6,24.4 32.6,14.45 | 32.6,14.45 v32.6,2.2 | v42,2.2 M2.5V | v88.4,3 88.5,3.1 ICSP.2 88.5,6.6 88.8,6.9 C3.1 | C3.1 C4.1 90.85,12.4 v91.7,12.4 | C3.1 87.65,12.45 87.2,12 VR33.3
  Bottom 0.4: v32.6,2.2 17.3,2.2 v16.15,3.35
  Bottom 0.6: v32.6,2.2 v42,2.2 87.8,2.2 88.4,2.8 v88.4,3 | SERIAL.3 115.88,17.68 110.6,12.4 v91.7,12.4

### Text on the board
tPlace: NES Programmer | M n e m o s y n e | RX | Rev. B (2024-02) | TX
bPlace: MNEMOSYNE | NES Programmer | Rev. B (2024-02) | by Circuit Monkey